# EAGLE design 297-298 (EAGLE 7.2.0)
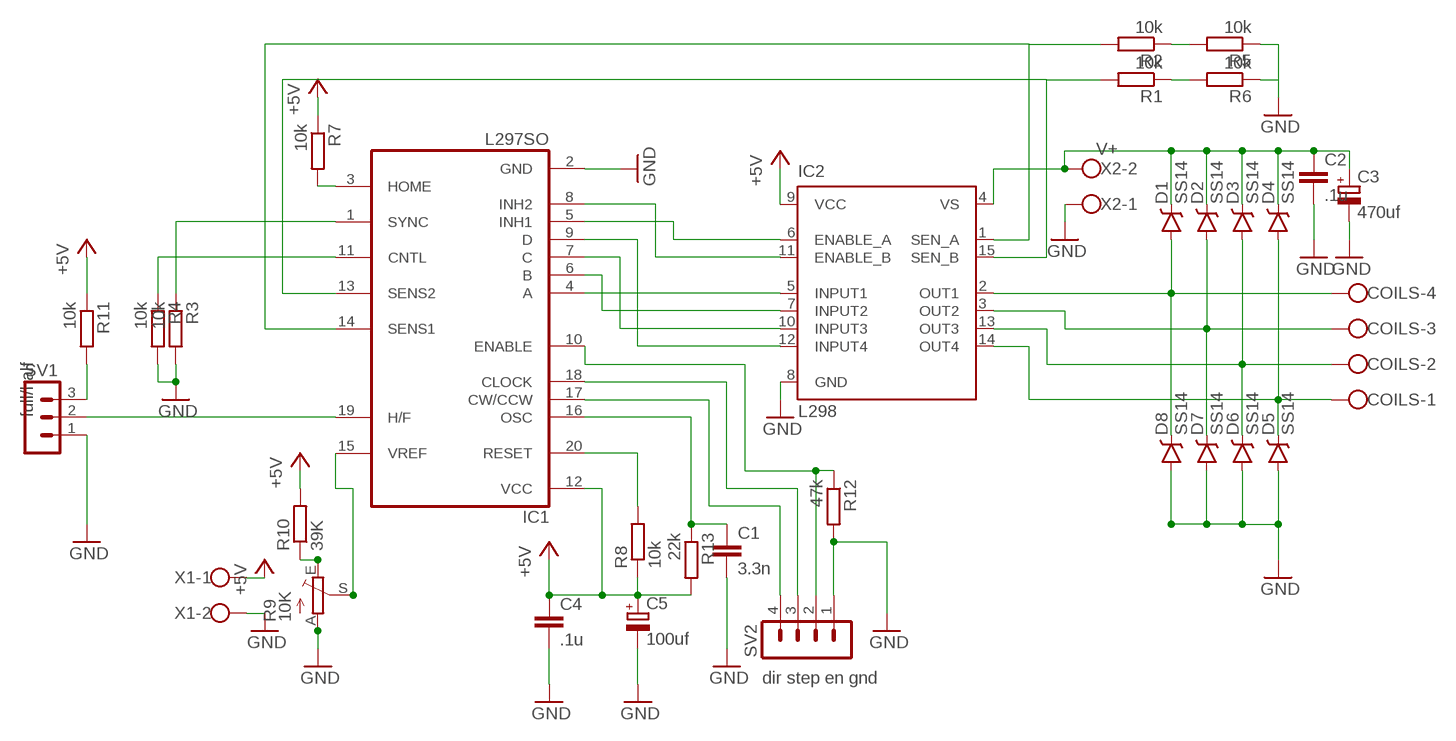
[diagram p0: schematic, sheet 1]

## Parts
C1  3.3n  CC0805  [C0805]
C2  .1u  CC0805  [C0805]
C3  470uf  CPOL-EUE3.5-8  [E3,5-8]
C4  .1u  CC0805  [C0805]
C5  100uf  CPOL-EUE3.5-8  [E3,5-8]
COILS  W237-4  [W237-4]
D1  SS14  [SMA-DIODE]
D2  SS14  [SMA-DIODE]
D3  SS14  [SMA-DIODE]
D4  SS14  [SMA-DIODE]
D5  SS14  [SMA-DIODE]
D6  SS14  [SMA-DIODE]
D7  SS14  [SMA-DIODE]
D8  SS14  [SMA-DIODE]
IC1  L297SO  [SO20]
IC2  L298  [MULTIWATT-15]
R1  10k  R2512  [R2512]
R2  10k  R2512  [R2512]
R3  10k  R0805  [R0805]
R4  10k  R0805  [R0805]
R5  10k  R2512  [R2512]
R6  10k  R2512  [R2512]
R7  10k  R0805  [R0805]
R8  10k  R0805  [R0805]
R9  10K  TRIM_EU-CA9V  [CA9V]
R10  39K  R0805  [R0805]
R11  10k  R0805  [R0805]
R12  47k  R0805  [R0805]
R13  22k  R0805  [R0805]
SV1  MA03-1  [MA03-1]
SV2  MA04-1  [MA04-1]
X1  W237-102  [W237-102]
X2  V+  W237-102  [W237-102]

## Nets
+5V: C4.1 C5.+ IC1.12(VCC) IC2.9(VCC) R7.1 R8.1 R10.2 R11.1 R13.2 X1.1
GND: C1.2 C2.2 C3.- C4.2 C5.- D5.A D6.A D7.A D8.A IC1.2(GND) IC2.8(GND) R3.2 R4.2 R5.P$1 R6.P$1 R9.A R12.2 SV1.1 SV2.1 X1.2 X2.1
N$1: IC1.4(A) IC2.5(INPUT1)
N$2: IC1.6(B) IC2.7(INPUT2)
N$3: IC1.7(C) IC2.10(INPUT3)
N$4: IC1.9(D) IC2.12(INPUT4)
N$5: IC1.8(INH2) IC2.11(ENABLE_B)
N$6: IC1.5(INH1) IC2.6(ENABLE_A)
N$7: IC1.15(VREF) R9.S
N$8: R9.E R10.1
N$9: COILS.4 D1.A D8.C IC2.2(OUT1)
N$10: COILS.3 D2.A D7.C IC2.3(OUT2)
N$11: COILS.2 D3.A D6.C IC2.13(OUT3)
N$12: COILS.1 D4.A D5.C IC2.14(OUT4)
N$13: IC1.13(SENS2) IC2.15(SEN_B) R1.P$2
N$14: IC1.14(SENS1) IC2.1(SEN_A) R2.P$2
N$15: IC1.1(SYNC) R3.1
N$16: IC1.19(H/F) SV1.2
N$17: R11.2 SV1.3
N$18: IC1.10(ENABLE) R12.1 SV2.2
N$19: IC1.18(CLOCK) SV2.3
N$20: IC1.17(CW/CCW) SV2.4
N$21: C1.1 IC1.16(OSC) R13.1
N$22: IC1.11(CNTL) R4.1
N$23: IC1.3(HOME) R7.2
N$24: C2.1 C3.+ D1.C D2.C D3.C D4.C IC2.4(VS) X2.2
N$25: IC1.20(RESET) R8.2
N$26: R2.P$1 R5.P$2
N$27: R1.P$1 R6.P$2

## Notes on the sheet
- full/half
- dir step en gnd

## Library data of the parts
C1 C2 C4 = CasaLibrary:C: Capacitor
C3 C5 = rcl:CPOL-EU: POLARIZED CAPACITOR, European symbol
COILS = con-wago-500:W237-4: WAGO SCREW CLAMP; OC_FARNELL: unknown; OC_NEWARK: unknown
D1-D8 = CasaLibrary:SS14
IC1 = st-microelectronics:L297: STEPPER MOTOR CONTROLLER
IC2 = st-microelectronics:L298: DUAL FULL-BRIDGE DRIVER; MPN: L298N; OC_FARNELL: 1589425; OC_NEWARK: 32M1527
R1-R8 R10-R13 = CasaLibrary:R
R9 = pot:TRIM_EU-: POTENTIOMETER
SV1 = con-lstb:MA03-1: PIN HEADER; OC_FARNELL: unknown; OC_NEWARK: unknown
SV2 = con-lstb:MA04-1: PIN HEADER; OC_FARNELL: unknown; OC_NEWARK: unknown
X1 X2 = con-wago-500:W237-102: WAGO SCREW CLAMP; MPN: 237-102; OC_FARNELL: unknown; OC_NEWARK: 70K9898

## Board
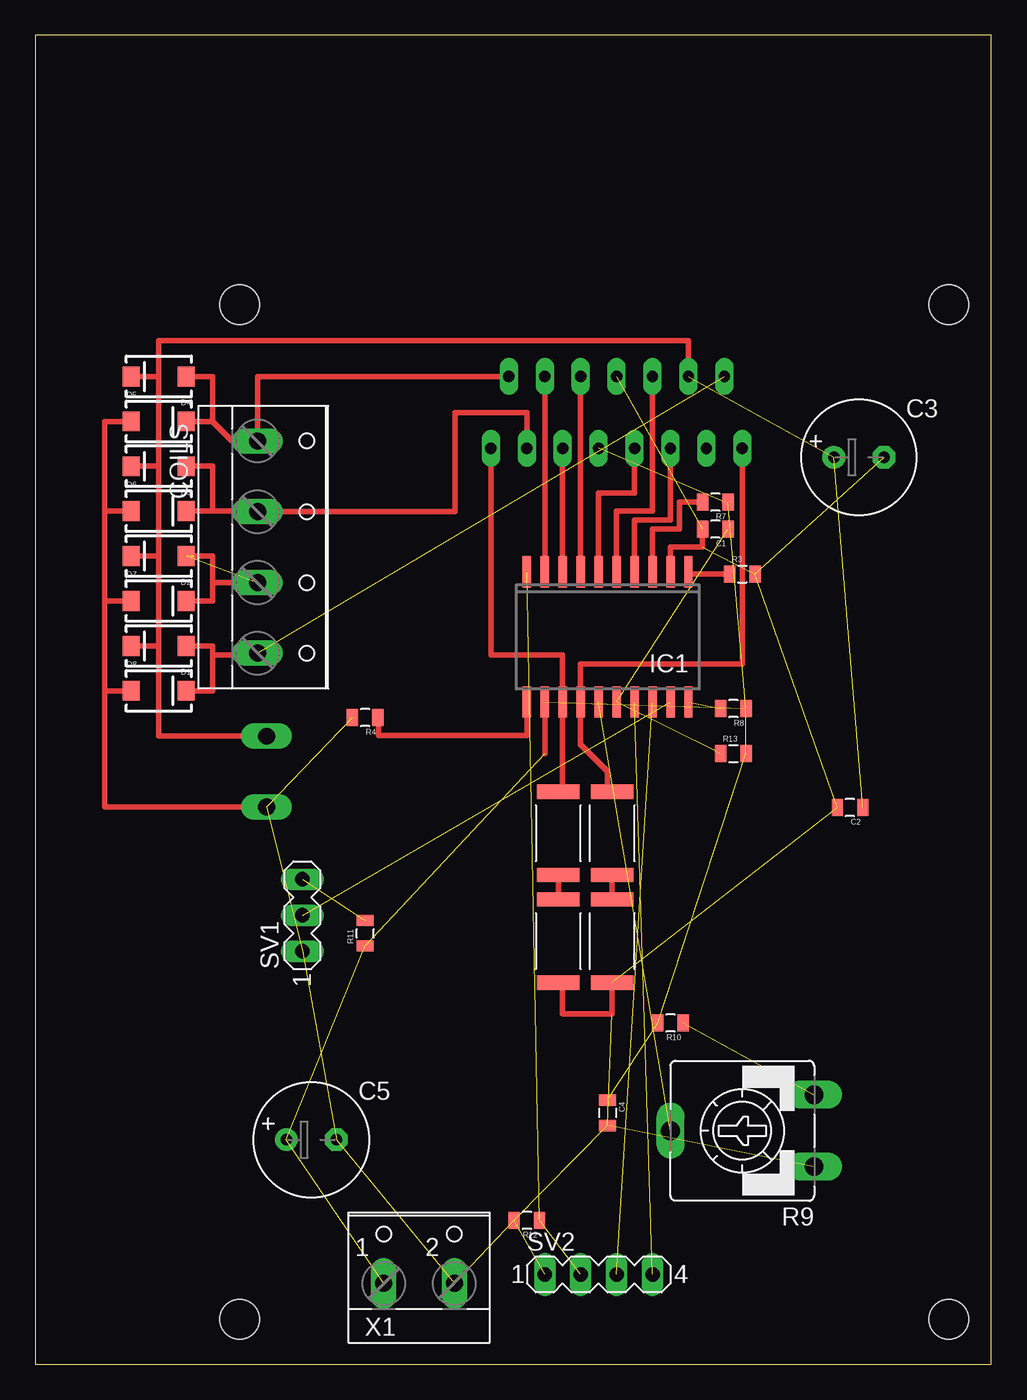
[diagram p1: board, top side]
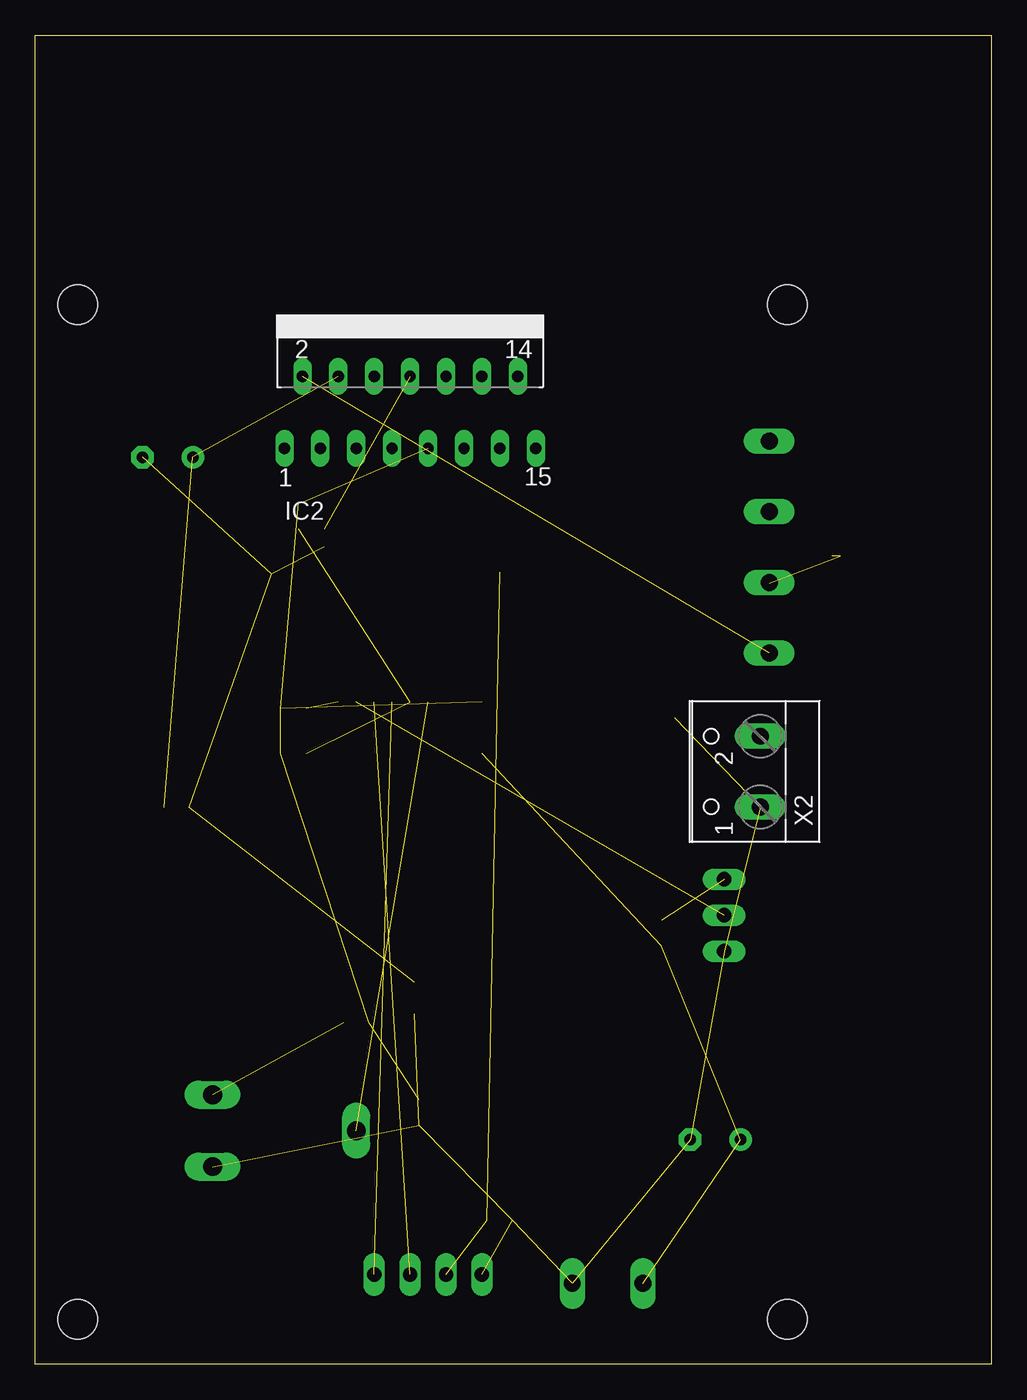
[diagram p2: board, bottom side, seen from below]

Size 67.62 x 93.97 mm. Coordinates in mm from the lower left corner, seen from the top.
Outline: 0,0 67.62,0 67.62,93.97 0,93.97 0,0
Copper layers (1*16): Top 0.035mm / dielectric 1.5mm / Bottom 0.035mm
Design rules "default *": minimum track width 30mil, minimum drill 24mil, track to track 8mil, track to pad 8mil, pad to pad 8mil, via to via 8mil, smd to smd 8mil, copper to edge 40mil, drill to drill 8mil, minimum pad ring 10mil, minimum via ring 8mil, stop-mask expansion 4mil, vias tented up to drill 0mil, thermal gap 10mil
Holes 2.8 mm at 14.44,74.92 64.61,74.92 64.61,3.17 14.44,3.17

### Footprints (pad centres in the part's own frame; a part is rotated, then mirrored left to right if it is on the bottom)
C0805 = smd 0.8 x 1.2: 1 -0.9,0; 2 0.9,0
E3,5-8 = drill 0.813 pad 1.6: + -1.778,0 | drill 0.813 pad 1.6 octagon: - 1.778,0
W237-4 = drill 1.194 long: 1 -7.5,-1.27; 2 -2.5,-1.27; 3 2.5,-1.27; 4 7.5,-1.27
SMA-DIODE = smd 1.2 x 1.4: A -1.95,0; C 1.95,0
SO20 = smd 0.6 x 2.2: 1 -5.715,-4.6; 2 -4.445,-4.6; 3 -3.175,-4.6; 4 -1.905,-4.6; 5 -0.635,-4.6; 6 0.635,-4.6; 7 1.905,-4.6; 8 3.175,-4.6; 9 4.445,-4.6; 10 5.715,-4.6; 11 5.715,4.6; 12 4.445,4.6; 13 3.175,4.6; 14 1.905,4.6; 15 0.635,4.6; 16 -0.635,4.6; 17 -1.905,4.6; 18 -3.175,4.6; 19 -4.445,4.6; 20 -5.715,4.6
MULTIWATT-15 = drill 0.8 long: 1 -8.89,-7.62; 2 -7.62,-2.54; 3 -6.35,-7.62; 4 -5.08,-2.54; 5 -3.81,-7.62; 6 -2.54,-2.54; 7 -1.27,-7.62; 8 0,-2.54; 9 1.27,-7.62; 10 2.54,-2.54; 11 3.81,-7.62; 12 5.08,-2.54; 13 6.35,-7.62; 14 7.62,-2.54; 15 8.89,-7.62
R2512 = smd 1 x 3: P$1 0.318,-1.587; P$2 6.191,-1.587
R0805 = smd 0.8 x 1.2: 1 -0.9,0; 2 0.9,0
CA9V = drill 1.321 long: A -2.54,-5.08; E 2.54,-5.08; S 0,5.08
MA03-1 = drill 1.016 long: 1 -2.54,0; 2 0,0; 3 2.54,0
MA04-1 = drill 1.016 long: 1 -3.81,0; 2 -1.27,0; 3 1.27,0; 4 3.81,0
W237-102 = drill 1.194 long: 1 -2.5,-1.27; 2 2.5,-1.27

### Placement (x,y rotation side)
C1  48.09,59.05 180 top
C2  57.62,39.37 180 top
C3  58.25,64.13 0 top
C4  40.48,17.77 270 top
C5  19.52,15.87 0 top
COILS  16.98,57.78 270 top
D1  8.73,50.8 180 top
D2  8.73,57.15 180 top
D3  8.73,63.5 180 top
D4  8.73,69.84 180 top
D5  8.73,66.67 0 top
D6  8.73,60.32 0 top
D7  8.73,53.97 0 top
D8  8.73,47.62 0 top
IC1  40.48,51.43 180 top
IC2  41.11,72.38 0 bottom
R1  35.4,34.29 90 top
R2  39.2,34.29 90 top
R3  50,55.88 0 top
R4  23.33,45.72 180 top
R5  39.2,26.66 90 top
R6  35.4,26.66 90 top
R7  48.09,60.96 180 top
R8  49.37,46.35 180 top
R9  50,16.5 90 top
R10  44.92,24.12 180 top
R11  23.33,30.47 90 top
R12  34.76,10.16 180 top
R13  49.37,43.18 0 top
SV1  18.89,31.74 90 top
SV2  39.84,6.34 0 top
X1  27.14,6.98 0 top
X2  17.62,41.91 90 bottom

### Tracks (layer width: path | path; a pad name or v marks a point on that pad's centre or on a via)
+5V  (9 unrouted)
  Top 0.406: IC1.12 36.03,43.18 | R7.1 48.73,60.96
GND  (14 unrouted)
  Top 0.406: C1.2 47.2,57.78 44.92,57.78 IC1.2 | R6.P$1 37.3,26.66 37.3,24.76 40.79,24.76 R5.P$1 | D8.A 4.92,47.62 | 4.92,47.62 4.92,53.97 | 4.92,53.97 4.92,60.32 | 4.92,60.32 4.92,66.67 D5.A | D6.A 4.92,60.32 | D7.A 4.92,53.97 | X2.1 4.92,39.41 4.92,47.62
N$1
  Top 0.406: IC1.4 42.38,59.69 44.92,59.69 IC2.5
N$2
  Top 0.406: IC1.6 39.84,61.59 42.38,61.59 IC2.7
N$3
  Top 0.406: IC1.7 IC2.10
N$4
  Top 0.406: IC1.9 IC2.12
N$5
  Top 0.406: IC1.8 IC2.11
N$6
  Top 0.406: IC1.5 41.11,60.32 43.65,60.32 IC2.6
N$7  (1 unrouted)
N$8  (1 unrouted)
N$9  (1 unrouted)
  Top 0.406: COILS.4 15.71,50.16 12.54,50.16 | 12.54,50.16 12.54,50.8 D1.A | D8.C 12.54,47.62 12.54,50.16
N$10  (2 unrouted)
  Top 0.406: 12.54,55.28 COILS.3 15.71,55.24 | 12.54,55.28 12.54,57.15 11.27,57.15 | 12.54,55.28 12.54,53.97 D7.C
N$11
  Top 0.406: IC2.13 34.76,67.3 29.68,67.3 29.68,60.28 COILS.2 15.71,60.32 D6.C 12.54,60.32 12.54,63.5 D3.A
N$12
  Top 0.406: IC2.14 15.71,69.84 COILS.1 13.93,65.28 12.54,66.67 | 12.54,66.67 D5.C | D4.A 12.54,69.84 12.54,66.67
N$13
  Top 0.406: IC2.15 32.22,50.16 37.3,50.16 IC1.13 37.3,40.79 R1.P$2
N$14
  Top 0.406: IC2.1 50,49.53 38.57,49.53 IC1.14 38.57,43.81 40.48,41.91 40.48,40.48 R2.P$2
N$15
  Top 0.406: R3.1 46.19,55.88 IC1.1
N$16  (1 unrouted)
N$17  (1 unrouted)
N$18  (2 unrouted)
N$19  (1 unrouted)
N$20  (1 unrouted)
N$21  (2 unrouted)
N$22
  Top 0.406: R4.1 24.28,44.45 34.76,44.45 IC1.11
N$23
  Top 0.406: IC1.3 43.65,59.05 45.55,59.05 45.55,60.96 R7.2
N$24  (2 unrouted)
  Top 0.406: D4.C 8.73,69.84 | 8.73,69.84 8.73,63.5 | 8.73,63.5 8.73,57.15 | D1.C 8.73,50.8 | 8.73,50.8 8.73,57.15 | 8.73,57.15 D2.C | D3.C 8.73,63.5 | X2.2 8.73,44.41 8.73,50.8 | 8.73,69.84 8.73,72.38 46.19,72.38 IC2.4
N$25  (1 unrouted)
N$26
  Top 0.406: R2.P$1 R5.P$2
N$27
  Top 0.406: R1.P$1 R6.P$2